# Altium schematic sheet Sheet1.SchDoc
size A; SheetNumber: 1; SheetTotal: 1
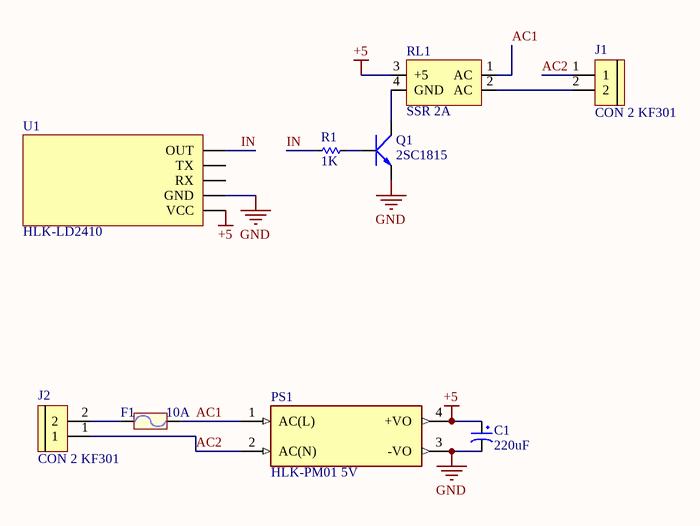
[diagram p0: Sheet1.SchDoc]

## Parts
C1  220uF  [Tu hoa 5mm]
F1  10A  [Fuse vertical]
J1  CON 2 KF301  [Con 2 KF301 5.08]
J2  CON 2 KF301  [Con 2 KF301 5.08]
PS1  HLK-PM01 5V  [CONV_HLK-PM01]
Q1  2SC1815  [TO92-123]
R1  1K  [RES-1/4W]
RL1  SSR 2A  [G3MB-202P]
U1  HLK-LD2410  [HLK-LD2410]

## Nets
+5: C1.1 PS1.4(+VO) RL1.3(+5) U1.5(VCC)
GND: C1.2 PS1.3(-VO) Q1.1(E) U1.4(GND)
AC1: F1.2 PS1.1(AC(L)) RL1.1(AC)
AC2: J1.1 J2.1 PS1.2(AC(N))
IN: R1.2 U1.1(OUT)
NetF1_1: F1.1 J2.2
NetJ1_2: J1.2 RL1.2(AC)
NetQ1_2: Q1.2(C) RL1.4(GND)
NetQ1_3: Q1.3(B) R1.1

Not connected (* = marked no-connect by the designer): U1 2(TX) 3(RX)

## Library data of the parts
C1 = Tu Hoa 220uF 16V 6x11: Cắm; Don_Vi: Con; So_Chan: 2; Ten_Linh_Kien: Tụ Hóa 220uF 16V 6x11MM; Ma_Hang: MH001348; Chung_Loai: Cắm; Kieu_Chan: *
F1 = Fuse: Designed by: VanDungEvn; Value: Fuse
J1 J2 = CON 2 KF301: Cắm; Ma_Hang: MH000987; Ten_Linh_Kien: CON 2 KF301-2P 5.08MM Xanh Dương; Chung_Loai: Cắm; Ghi_Chu: *; Kieu_Chan: *; Don_Vi: Con
PS1 = CONV HLK-PM01: 220VAC to 5V 3W; MF: Hi-link; MP: HLK-20M12; Check_prices: https://www.snapeda.com/parts/HLK-20M12/Hi-link/view-part/?ref=eda; SnapEDA_Link: https://www.snapeda.com/parts/HLK-20M12/Hi-link/view-part/?ref=snap; Availability: Not in stock; Price: None; Value: *; Package: Non-Standard Hi-link
Q1 = 2SC1815: NPN 600mW, ECB; Value: C1815
R1 = Res
RL1 = SSR G3MB-202P: SSR 5V 2A; ComponentLink1Description: Datasheet; ComponentLink1URL: https://www.omron-russia.com/doc/relay/ssr/g3mb.pdf
U1 = HLK-LD2410: HLK-LD2410B-P Cam bien hien dien